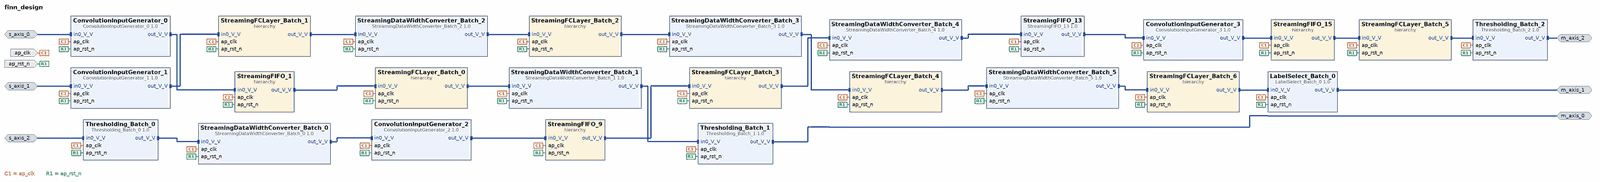
[diagram p0: block diagram of the top level, whole]
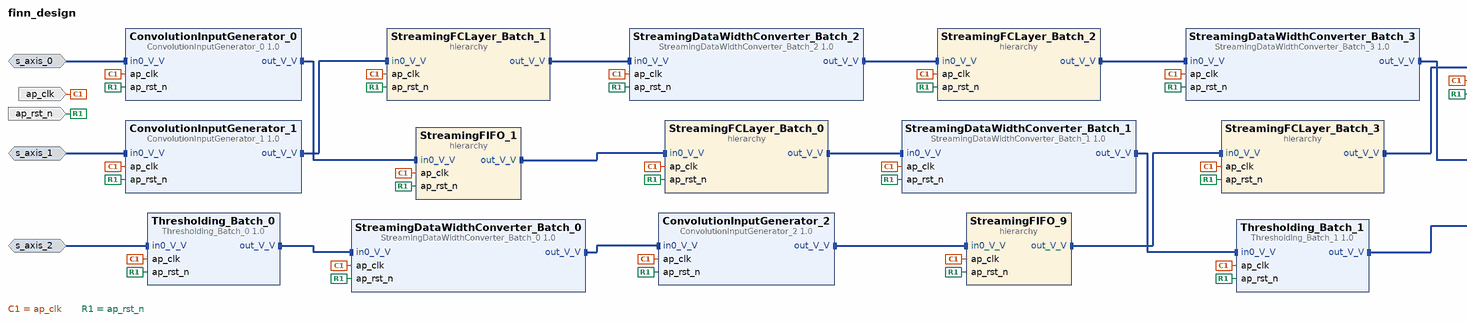
[diagram p1: block diagram of the top level, left part]
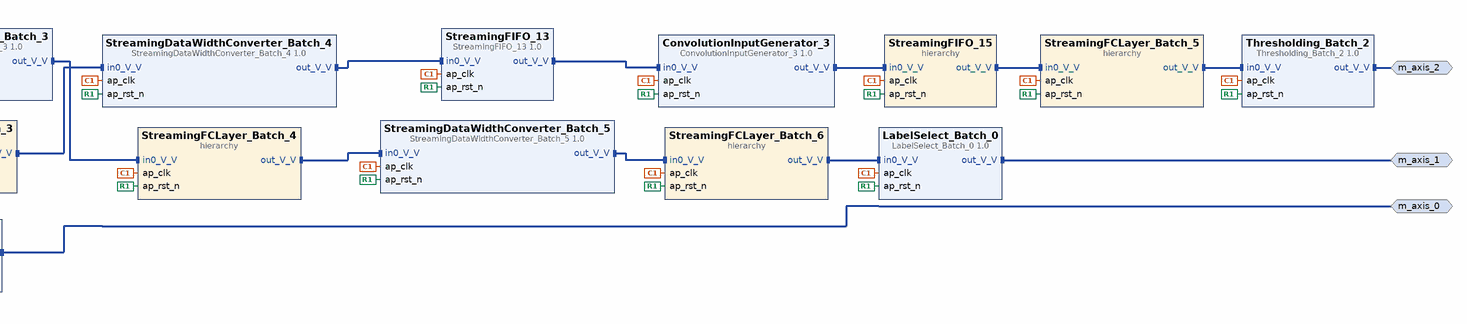
[diagram p2: block diagram of the top level, right part]
# Vivado block design finn_design, xc7z020clg400-1, Vivado 2020.1.1
create_bd_design finn_design

create_bd_intf_port -mode Slave -vlnv xilinx.com:interface:axis_rtl:1.0 s_axis_0
set_property -dict [list \
  CONFIG.TDATA_NUM_BYTES 1 \
  CONFIG.TDEST_WIDTH 0 \
  CONFIG.TID_WIDTH 0 \
  CONFIG.TUSER_WIDTH 0 \
  CONFIG.HAS_TREADY 1 \
  CONFIG.HAS_TSTRB 0 \
  CONFIG.HAS_TKEEP 0 \
  CONFIG.HAS_TLAST 0 \
  CONFIG.FREQ_HZ 100000000.000000 \
  CONFIG.LAYERED_METADATA undef \
] [get_bd_intf_ports s_axis_0]
create_bd_intf_port -mode Slave -vlnv xilinx.com:interface:axis_rtl:1.0 s_axis_1
set_property -dict [list \
  CONFIG.TDATA_NUM_BYTES 2 \
  CONFIG.TDEST_WIDTH 0 \
  CONFIG.TID_WIDTH 0 \
  CONFIG.TUSER_WIDTH 0 \
  CONFIG.HAS_TREADY 1 \
  CONFIG.HAS_TSTRB 0 \
  CONFIG.HAS_TKEEP 0 \
  CONFIG.HAS_TLAST 0 \
  CONFIG.FREQ_HZ 100000000.000000 \
  CONFIG.LAYERED_METADATA undef \
] [get_bd_intf_ports s_axis_1]
create_bd_intf_port -mode Slave -vlnv xilinx.com:interface:axis_rtl:1.0 s_axis_2
set_property -dict [list \
  CONFIG.TDATA_NUM_BYTES 1 \
  CONFIG.TDEST_WIDTH 0 \
  CONFIG.TID_WIDTH 0 \
  CONFIG.TUSER_WIDTH 0 \
  CONFIG.HAS_TREADY 1 \
  CONFIG.HAS_TSTRB 0 \
  CONFIG.HAS_TKEEP 0 \
  CONFIG.HAS_TLAST 0 \
  CONFIG.FREQ_HZ 100000000.000000 \
  CONFIG.LAYERED_METADATA undef \
] [get_bd_intf_ports s_axis_2]
create_bd_intf_port -mode Master -vlnv xilinx.com:interface:axis_rtl:1.0 m_axis_0
set_property -dict {CONFIG.FREQ_HZ 100000000.000000} [get_bd_intf_ports m_axis_0]
create_bd_intf_port -mode Master -vlnv xilinx.com:interface:axis_rtl:1.0 m_axis_1
set_property -dict {CONFIG.FREQ_HZ 100000000.000000} [get_bd_intf_ports m_axis_1]
create_bd_intf_port -mode Master -vlnv xilinx.com:interface:axis_rtl:1.0 m_axis_2
set_property -dict {CONFIG.FREQ_HZ 100000000.000000} [get_bd_intf_ports m_axis_2]
create_bd_port -dir I -type clk ap_clk
set_property -dict {CONFIG.FREQ_HZ 100000000.000000} [get_bd_ports ap_clk]
create_bd_port -dir I -type rst ap_rst_n

create_bd_cell -type ip -vlnv xilinx.com:hls:ConvolutionInputGenerator_0:1.0 ConvolutionInputGenerator_0
create_bd_cell -type ip -vlnv xilinx.com:hls:ConvolutionInputGenerator_1:1.0 ConvolutionInputGenerator_1
create_bd_cell -type ip -vlnv xilinx.com:hls:Thresholding_Batch_0:1.0 Thresholding_Batch_0
create_bd_cell -type hier StreamingFIFO_1
create_bd_cell -type hier StreamingFCLayer_Batch_1
create_bd_cell -type ip -vlnv xilinx.com:hls:StreamingDataWidthConverter_Batch_0:1.0 StreamingDataWidthConverter_Batch_0
create_bd_cell -type hier StreamingFCLayer_Batch_0
create_bd_cell -type ip -vlnv xilinx.com:hls:StreamingDataWidthConverter_Batch_2:1.0 StreamingDataWidthConverter_Batch_2
create_bd_cell -type ip -vlnv xilinx.com:hls:ConvolutionInputGenerator_2:1.0 ConvolutionInputGenerator_2
create_bd_cell -type ip -vlnv xilinx.com:hls:StreamingDataWidthConverter_Batch_1:1.0 StreamingDataWidthConverter_Batch_1
create_bd_cell -type hier StreamingFIFO_9
create_bd_cell -type hier StreamingFCLayer_Batch_2
create_bd_cell -type ip -vlnv xilinx.com:hls:Thresholding_Batch_1:1.0 Thresholding_Batch_1
create_bd_cell -type hier StreamingFCLayer_Batch_3
create_bd_cell -type ip -vlnv xilinx.com:hls:StreamingDataWidthConverter_Batch_3:1.0 StreamingDataWidthConverter_Batch_3
create_bd_cell -type ip -vlnv xilinx.com:hls:StreamingDataWidthConverter_Batch_4:1.0 StreamingDataWidthConverter_Batch_4
create_bd_cell -type hier StreamingFCLayer_Batch_4
create_bd_cell -type ip -vlnv xilinx.com:hls:StreamingFIFO_13:1.0 StreamingFIFO_13
create_bd_cell -type ip -vlnv xilinx.com:hls:StreamingDataWidthConverter_Batch_5:1.0 StreamingDataWidthConverter_Batch_5
create_bd_cell -type ip -vlnv xilinx.com:hls:ConvolutionInputGenerator_3:1.0 ConvolutionInputGenerator_3
create_bd_cell -type hier StreamingFCLayer_Batch_6
create_bd_cell -type hier StreamingFIFO_15
create_bd_cell -type ip -vlnv xilinx.com:hls:LabelSelect_Batch_0:1.0 LabelSelect_Batch_0
create_bd_cell -type hier StreamingFCLayer_Batch_5
create_bd_cell -type ip -vlnv xilinx.com:hls:Thresholding_Batch_2:1.0 Thresholding_Batch_2

# ---- hierarchy /StreamingFIFO_1 ----
current_bd_instance /StreamingFIFO_1
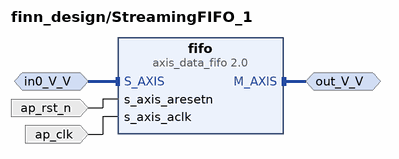
[diagram p3: block diagram inside /StreamingFIFO_1]
create_bd_intf_pin -mode Master -vlnv xilinx.com:interface:axis_rtl:1.0 out_V_V
create_bd_intf_pin -mode Slave -vlnv xilinx.com:interface:axis_rtl:1.0 in0_V_V
create_bd_pin -dir I -type clk ap_clk
create_bd_pin -dir I -type rst ap_rst_n

create_bd_cell -type ip -vlnv xilinx.com:ip:axis_data_fifo:2.0 fifo
set_property -dict {CONFIG.FIFO_DEPTH 8192 CONFIG.FIFO_MEMORY_TYPE auto CONFIG.TDATA_NUM_BYTES 1} [get_bd_cells fifo]

# ---- hierarchy /StreamingFCLayer_Batch_1 ----
current_bd_instance /StreamingFCLayer_Batch_1
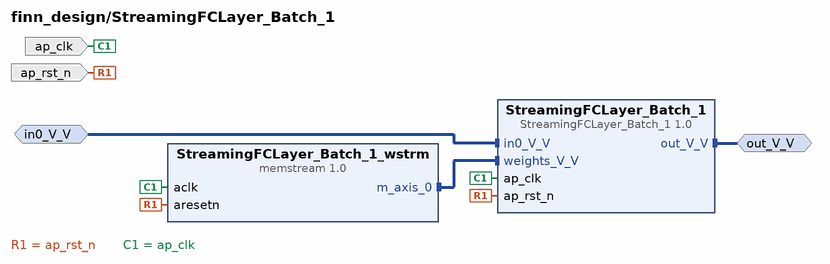
[diagram p4: block diagram inside /StreamingFCLayer_Batch_1]
create_bd_intf_pin -mode Master -vlnv xilinx.com:interface:axis_rtl:1.0 out_V_V
create_bd_intf_pin -mode Slave -vlnv xilinx.com:interface:axis_rtl:1.0 in0_V_V
create_bd_pin -dir I -type clk ap_clk
create_bd_pin -dir I -type rst ap_rst_n

create_bd_cell -type ip -vlnv xilinx.com:hls:StreamingFCLayer_Batch_1:1.0 StreamingFCLayer_Batch_1
create_bd_cell -type ip -vlnv xilinx.com:user:memstream:1.0 StreamingFCLayer_Batch_1_wstrm
set_property -dict [list \
  CONFIG.MEM_DEPTH 36864 \
  CONFIG.MEM_INIT /home/grgov/Diplomski_rad/finn_modified_docker_output_dir/code_gen_ipgen_StreamingFCLayer_Batch_1_gj26dggu/ \
  CONFIG.MEM_WIDTH 64 \
  CONFIG.NSTREAMS 1 \
  CONFIG.RAM_STYLE auto \
  CONFIG.STRM0_DEPTH 36864 \
  CONFIG.STRM0_OFFSET 0 \
  CONFIG.STRM0_WIDTH 64 \
] [get_bd_cells StreamingFCLayer_Batch_1_wstrm]

# ---- hierarchy /StreamingFCLayer_Batch_0 ----
current_bd_instance /StreamingFCLayer_Batch_0
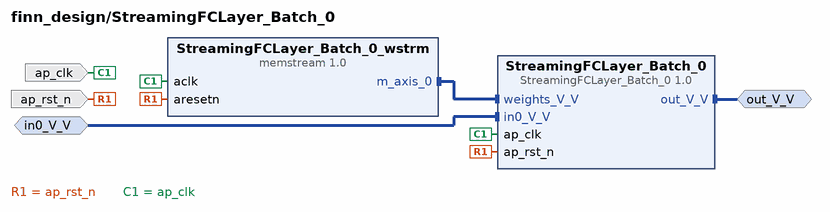
[diagram p5: block diagram inside /StreamingFCLayer_Batch_0]
create_bd_intf_pin -mode Master -vlnv xilinx.com:interface:axis_rtl:1.0 out_V_V
create_bd_intf_pin -mode Slave -vlnv xilinx.com:interface:axis_rtl:1.0 in0_V_V
create_bd_pin -dir I -type clk ap_clk
create_bd_pin -dir I -type rst ap_rst_n

create_bd_cell -type ip -vlnv xilinx.com:hls:StreamingFCLayer_Batch_0:1.0 StreamingFCLayer_Batch_0
create_bd_cell -type ip -vlnv xilinx.com:user:memstream:1.0 StreamingFCLayer_Batch_0_wstrm
set_property -dict [list \
  CONFIG.MEM_DEPTH 18432 \
  CONFIG.MEM_INIT /home/grgov/Diplomski_rad/finn_modified_docker_output_dir/code_gen_ipgen_StreamingFCLayer_Batch_0_a2ilano3/ \
  CONFIG.MEM_WIDTH 32 \
  CONFIG.NSTREAMS 1 \
  CONFIG.RAM_STYLE auto \
  CONFIG.STRM0_DEPTH 18432 \
  CONFIG.STRM0_OFFSET 0 \
  CONFIG.STRM0_WIDTH 32 \
] [get_bd_cells StreamingFCLayer_Batch_0_wstrm]

# ---- hierarchy /StreamingFIFO_9 ----
current_bd_instance /StreamingFIFO_9
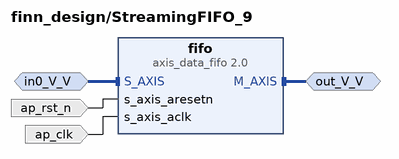
[diagram p6: block diagram inside /StreamingFIFO_9]
create_bd_intf_pin -mode Master -vlnv xilinx.com:interface:axis_rtl:1.0 out_V_V
create_bd_intf_pin -mode Slave -vlnv xilinx.com:interface:axis_rtl:1.0 in0_V_V
create_bd_pin -dir I -type clk ap_clk
create_bd_pin -dir I -type rst ap_rst_n

create_bd_cell -type ip -vlnv xilinx.com:ip:axis_data_fifo:2.0 fifo
set_property -dict {CONFIG.FIFO_DEPTH 512 CONFIG.FIFO_MEMORY_TYPE auto CONFIG.TDATA_NUM_BYTES 3} [get_bd_cells fifo]

# ---- hierarchy /StreamingFCLayer_Batch_2 ----
current_bd_instance /StreamingFCLayer_Batch_2
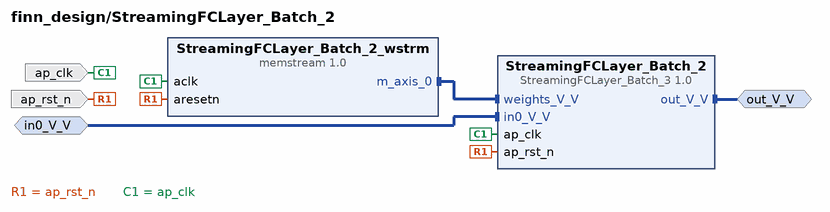
[diagram p7: block diagram inside /StreamingFCLayer_Batch_2]
create_bd_intf_pin -mode Master -vlnv xilinx.com:interface:axis_rtl:1.0 out_V_V
create_bd_intf_pin -mode Slave -vlnv xilinx.com:interface:axis_rtl:1.0 in0_V_V
create_bd_pin -dir I -type clk ap_clk
create_bd_pin -dir I -type rst ap_rst_n

create_bd_cell -type ip -vlnv xilinx.com:hls:StreamingFCLayer_Batch_3:1.0 StreamingFCLayer_Batch_2
create_bd_cell -type ip -vlnv xilinx.com:user:memstream:1.0 StreamingFCLayer_Batch_2_wstrm
set_property -dict [list \
  CONFIG.MEM_DEPTH 4096 \
  CONFIG.MEM_INIT /home/grgov/Diplomski_rad/finn_modified_docker_output_dir/code_gen_ipgen_StreamingFCLayer_Batch_3_u6fssgdv/ \
  CONFIG.MEM_WIDTH 128 \
  CONFIG.NSTREAMS 1 \
  CONFIG.RAM_STYLE block \
  CONFIG.STRM0_DEPTH 4096 \
  CONFIG.STRM0_OFFSET 0 \
  CONFIG.STRM0_WIDTH 128 \
] [get_bd_cells StreamingFCLayer_Batch_2_wstrm]

# ---- hierarchy /StreamingFCLayer_Batch_3 ----
current_bd_instance /StreamingFCLayer_Batch_3
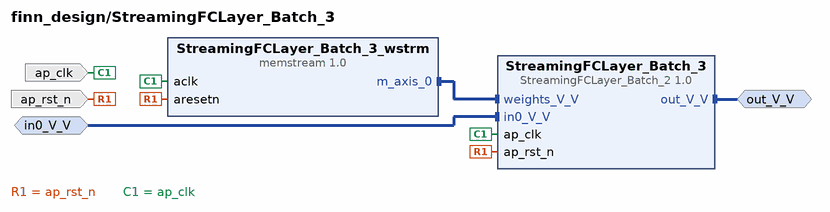
[diagram p8: block diagram inside /StreamingFCLayer_Batch_3]
create_bd_intf_pin -mode Master -vlnv xilinx.com:interface:axis_rtl:1.0 out_V_V
create_bd_intf_pin -mode Slave -vlnv xilinx.com:interface:axis_rtl:1.0 in0_V_V
create_bd_pin -dir I -type clk ap_clk
create_bd_pin -dir I -type rst ap_rst_n

create_bd_cell -type ip -vlnv xilinx.com:hls:StreamingFCLayer_Batch_2:1.0 StreamingFCLayer_Batch_3
create_bd_cell -type ip -vlnv xilinx.com:user:memstream:1.0 StreamingFCLayer_Batch_3_wstrm
set_property -dict [list \
  CONFIG.MEM_DEPTH 144 \
  CONFIG.MEM_INIT /home/grgov/Diplomski_rad/finn_modified_docker_output_dir/code_gen_ipgen_StreamingFCLayer_Batch_2_4yckv8t4/ \
  CONFIG.MEM_WIDTH 48 \
  CONFIG.NSTREAMS 1 \
  CONFIG.RAM_STYLE auto \
  CONFIG.STRM0_DEPTH 144 \
  CONFIG.STRM0_OFFSET 0 \
  CONFIG.STRM0_WIDTH 48 \
] [get_bd_cells StreamingFCLayer_Batch_3_wstrm]

# ---- hierarchy /StreamingFCLayer_Batch_4 ----
current_bd_instance /StreamingFCLayer_Batch_4
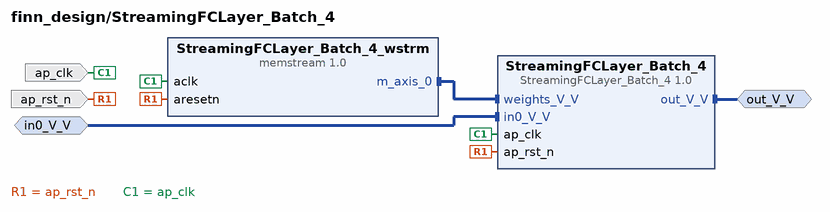
[diagram p9: block diagram inside /StreamingFCLayer_Batch_4]
create_bd_intf_pin -mode Master -vlnv xilinx.com:interface:axis_rtl:1.0 out_V_V
create_bd_intf_pin -mode Slave -vlnv xilinx.com:interface:axis_rtl:1.0 in0_V_V
create_bd_pin -dir I -type clk ap_clk
create_bd_pin -dir I -type rst ap_rst_n

create_bd_cell -type ip -vlnv xilinx.com:hls:StreamingFCLayer_Batch_4:1.0 StreamingFCLayer_Batch_4
create_bd_cell -type ip -vlnv xilinx.com:user:memstream:1.0 StreamingFCLayer_Batch_4_wstrm
set_property -dict [list \
  CONFIG.MEM_DEPTH 8192 \
  CONFIG.MEM_INIT /home/grgov/Diplomski_rad/finn_modified_docker_output_dir/code_gen_ipgen_StreamingFCLayer_Batch_4_2kaxius9/ \
  CONFIG.MEM_WIDTH 128 \
  CONFIG.NSTREAMS 1 \
  CONFIG.RAM_STYLE auto \
  CONFIG.STRM0_DEPTH 8192 \
  CONFIG.STRM0_OFFSET 0 \
  CONFIG.STRM0_WIDTH 128 \
] [get_bd_cells StreamingFCLayer_Batch_4_wstrm]

# ---- hierarchy /StreamingFCLayer_Batch_6 ----
current_bd_instance /StreamingFCLayer_Batch_6
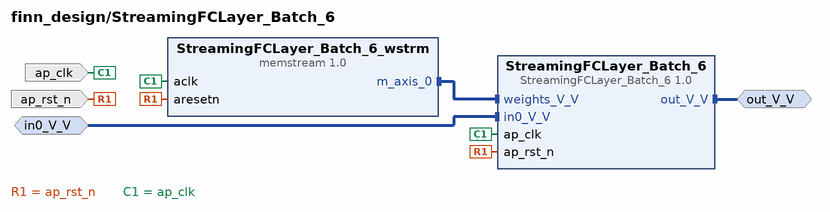
[diagram p10: block diagram inside /StreamingFCLayer_Batch_6]
create_bd_intf_pin -mode Master -vlnv xilinx.com:interface:axis_rtl:1.0 out_V_V
create_bd_intf_pin -mode Slave -vlnv xilinx.com:interface:axis_rtl:1.0 in0_V_V
create_bd_pin -dir I -type clk ap_clk
create_bd_pin -dir I -type rst ap_rst_n

create_bd_cell -type ip -vlnv xilinx.com:hls:StreamingFCLayer_Batch_6:1.0 StreamingFCLayer_Batch_6
create_bd_cell -type ip -vlnv xilinx.com:user:memstream:1.0 StreamingFCLayer_Batch_6_wstrm
set_property -dict [list \
  CONFIG.MEM_DEPTH 1792 \
  CONFIG.MEM_INIT /home/grgov/Diplomski_rad/finn_modified_docker_output_dir/code_gen_ipgen_StreamingFCLayer_Batch_6_e2ail04f/ \
  CONFIG.MEM_WIDTH 8 \
  CONFIG.NSTREAMS 1 \
  CONFIG.RAM_STYLE distributed \
  CONFIG.STRM0_DEPTH 1792 \
  CONFIG.STRM0_OFFSET 0 \
  CONFIG.STRM0_WIDTH 8 \
] [get_bd_cells StreamingFCLayer_Batch_6_wstrm]

# ---- hierarchy /StreamingFIFO_15 ----
current_bd_instance /StreamingFIFO_15
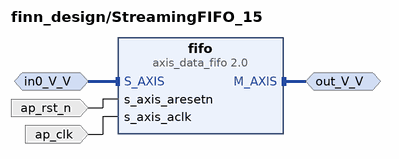
[diagram p11: block diagram inside /StreamingFIFO_15]
create_bd_intf_pin -mode Master -vlnv xilinx.com:interface:axis_rtl:1.0 out_V_V
create_bd_intf_pin -mode Slave -vlnv xilinx.com:interface:axis_rtl:1.0 in0_V_V
create_bd_pin -dir I -type clk ap_clk
create_bd_pin -dir I -type rst ap_rst_n

create_bd_cell -type ip -vlnv xilinx.com:ip:axis_data_fifo:2.0 fifo
set_property -dict {CONFIG.FIFO_DEPTH 2048 CONFIG.FIFO_MEMORY_TYPE auto CONFIG.TDATA_NUM_BYTES 4} [get_bd_cells fifo]

# ---- hierarchy /StreamingFCLayer_Batch_5 ----
current_bd_instance /StreamingFCLayer_Batch_5
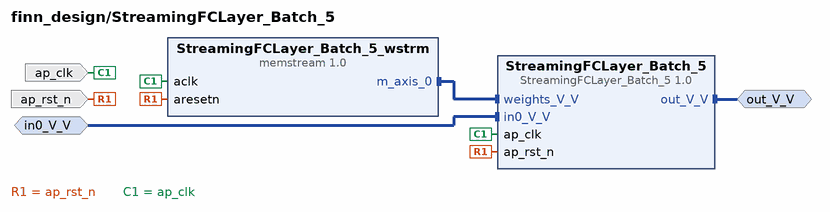
[diagram p12: block diagram inside /StreamingFCLayer_Batch_5]
create_bd_intf_pin -mode Master -vlnv xilinx.com:interface:axis_rtl:1.0 out_V_V
create_bd_intf_pin -mode Slave -vlnv xilinx.com:interface:axis_rtl:1.0 in0_V_V
create_bd_pin -dir I -type clk ap_clk
create_bd_pin -dir I -type rst ap_rst_n

create_bd_cell -type ip -vlnv xilinx.com:hls:StreamingFCLayer_Batch_5:1.0 StreamingFCLayer_Batch_5
create_bd_cell -type ip -vlnv xilinx.com:user:memstream:1.0 StreamingFCLayer_Batch_5_wstrm
set_property -dict [list \
  CONFIG.MEM_DEPTH 4608 \
  CONFIG.MEM_INIT /home/grgov/Diplomski_rad/finn_modified_docker_output_dir/code_gen_ipgen_StreamingFCLayer_Batch_5_g5ap2jtp/ \
  CONFIG.MEM_WIDTH 32 \
  CONFIG.NSTREAMS 1 \
  CONFIG.RAM_STYLE auto \
  CONFIG.STRM0_DEPTH 4608 \
  CONFIG.STRM0_OFFSET 0 \
  CONFIG.STRM0_WIDTH 32 \
] [get_bd_cells StreamingFCLayer_Batch_5_wstrm]

# ---- connections ----

current_bd_instance /StreamingFIFO_1
connect_bd_intf_net [get_bd_intf_pins out_V_V] [get_bd_intf_pins fifo/M_AXIS]
connect_bd_intf_net [get_bd_intf_pins in0_V_V] [get_bd_intf_pins fifo/S_AXIS]
connect_bd_net [get_bd_pins ap_rst_n] [get_bd_pins fifo/s_axis_aresetn]
connect_bd_net [get_bd_pins ap_clk] [get_bd_pins fifo/s_axis_aclk]

current_bd_instance /StreamingFCLayer_Batch_1
connect_bd_intf_net [get_bd_intf_pins out_V_V] [get_bd_intf_pins StreamingFCLayer_Batch_1/out_V_V]
connect_bd_intf_net [get_bd_intf_pins in0_V_V] [get_bd_intf_pins StreamingFCLayer_Batch_1/in0_V_V]
connect_bd_intf_net [get_bd_intf_pins StreamingFCLayer_Batch_1_wstrm/m_axis_0] [get_bd_intf_pins StreamingFCLayer_Batch_1/weights_V_V]
connect_bd_net [get_bd_pins ap_rst_n] [get_bd_pins StreamingFCLayer_Batch_1_wstrm/aresetn] [get_bd_pins StreamingFCLayer_Batch_1/ap_rst_n]
connect_bd_net [get_bd_pins ap_clk] [get_bd_pins StreamingFCLayer_Batch_1_wstrm/aclk] [get_bd_pins StreamingFCLayer_Batch_1/ap_clk]

current_bd_instance /StreamingFCLayer_Batch_0
connect_bd_intf_net [get_bd_intf_pins StreamingFCLayer_Batch_0_wstrm/m_axis_0] [get_bd_intf_pins StreamingFCLayer_Batch_0/weights_V_V]
connect_bd_intf_net [get_bd_intf_pins in0_V_V] [get_bd_intf_pins StreamingFCLayer_Batch_0/in0_V_V]
connect_bd_intf_net [get_bd_intf_pins out_V_V] [get_bd_intf_pins StreamingFCLayer_Batch_0/out_V_V]
connect_bd_net [get_bd_pins ap_rst_n] [get_bd_pins StreamingFCLayer_Batch_0_wstrm/aresetn] [get_bd_pins StreamingFCLayer_Batch_0/ap_rst_n]
connect_bd_net [get_bd_pins ap_clk] [get_bd_pins StreamingFCLayer_Batch_0_wstrm/aclk] [get_bd_pins StreamingFCLayer_Batch_0/ap_clk]

current_bd_instance /StreamingFIFO_9
connect_bd_intf_net [get_bd_intf_pins out_V_V] [get_bd_intf_pins fifo/M_AXIS]
connect_bd_intf_net [get_bd_intf_pins in0_V_V] [get_bd_intf_pins fifo/S_AXIS]
connect_bd_net [get_bd_pins ap_rst_n] [get_bd_pins fifo/s_axis_aresetn]
connect_bd_net [get_bd_pins ap_clk] [get_bd_pins fifo/s_axis_aclk]

current_bd_instance /StreamingFCLayer_Batch_2
connect_bd_intf_net [get_bd_intf_pins StreamingFCLayer_Batch_2_wstrm/m_axis_0] [get_bd_intf_pins StreamingFCLayer_Batch_2/weights_V_V]
connect_bd_intf_net [get_bd_intf_pins in0_V_V] [get_bd_intf_pins StreamingFCLayer_Batch_2/in0_V_V]
connect_bd_intf_net [get_bd_intf_pins out_V_V] [get_bd_intf_pins StreamingFCLayer_Batch_2/out_V_V]
connect_bd_net [get_bd_pins ap_rst_n] [get_bd_pins StreamingFCLayer_Batch_2_wstrm/aresetn] [get_bd_pins StreamingFCLayer_Batch_2/ap_rst_n]
connect_bd_net [get_bd_pins ap_clk] [get_bd_pins StreamingFCLayer_Batch_2_wstrm/aclk] [get_bd_pins StreamingFCLayer_Batch_2/ap_clk]

current_bd_instance /StreamingFCLayer_Batch_3
connect_bd_intf_net [get_bd_intf_pins StreamingFCLayer_Batch_3_wstrm/m_axis_0] [get_bd_intf_pins StreamingFCLayer_Batch_3/weights_V_V]
connect_bd_intf_net [get_bd_intf_pins in0_V_V] [get_bd_intf_pins StreamingFCLayer_Batch_3/in0_V_V]
connect_bd_intf_net [get_bd_intf_pins out_V_V] [get_bd_intf_pins StreamingFCLayer_Batch_3/out_V_V]
connect_bd_net [get_bd_pins ap_rst_n] [get_bd_pins StreamingFCLayer_Batch_3_wstrm/aresetn] [get_bd_pins StreamingFCLayer_Batch_3/ap_rst_n]
connect_bd_net [get_bd_pins ap_clk] [get_bd_pins StreamingFCLayer_Batch_3_wstrm/aclk] [get_bd_pins StreamingFCLayer_Batch_3/ap_clk]

current_bd_instance /StreamingFCLayer_Batch_4
connect_bd_intf_net [get_bd_intf_pins StreamingFCLayer_Batch_4_wstrm/m_axis_0] [get_bd_intf_pins StreamingFCLayer_Batch_4/weights_V_V]
connect_bd_intf_net [get_bd_intf_pins in0_V_V] [get_bd_intf_pins StreamingFCLayer_Batch_4/in0_V_V]
connect_bd_intf_net [get_bd_intf_pins out_V_V] [get_bd_intf_pins StreamingFCLayer_Batch_4/out_V_V]
connect_bd_net [get_bd_pins ap_rst_n] [get_bd_pins StreamingFCLayer_Batch_4_wstrm/aresetn] [get_bd_pins StreamingFCLayer_Batch_4/ap_rst_n]
connect_bd_net [get_bd_pins ap_clk] [get_bd_pins StreamingFCLayer_Batch_4_wstrm/aclk] [get_bd_pins StreamingFCLayer_Batch_4/ap_clk]

current_bd_instance /StreamingFCLayer_Batch_6
connect_bd_intf_net [get_bd_intf_pins StreamingFCLayer_Batch_6_wstrm/m_axis_0] [get_bd_intf_pins StreamingFCLayer_Batch_6/weights_V_V]
connect_bd_intf_net [get_bd_intf_pins in0_V_V] [get_bd_intf_pins StreamingFCLayer_Batch_6/in0_V_V]
connect_bd_intf_net [get_bd_intf_pins out_V_V] [get_bd_intf_pins StreamingFCLayer_Batch_6/out_V_V]
connect_bd_net [get_bd_pins ap_rst_n] [get_bd_pins StreamingFCLayer_Batch_6_wstrm/aresetn] [get_bd_pins StreamingFCLayer_Batch_6/ap_rst_n]
connect_bd_net [get_bd_pins ap_clk] [get_bd_pins StreamingFCLayer_Batch_6_wstrm/aclk] [get_bd_pins StreamingFCLayer_Batch_6/ap_clk]

current_bd_instance /StreamingFIFO_15
connect_bd_intf_net [get_bd_intf_pins out_V_V] [get_bd_intf_pins fifo/M_AXIS]
connect_bd_intf_net [get_bd_intf_pins in0_V_V] [get_bd_intf_pins fifo/S_AXIS]
connect_bd_net [get_bd_pins ap_rst_n] [get_bd_pins fifo/s_axis_aresetn]
connect_bd_net [get_bd_pins ap_clk] [get_bd_pins fifo/s_axis_aclk]

current_bd_instance /StreamingFCLayer_Batch_5
connect_bd_intf_net [get_bd_intf_pins StreamingFCLayer_Batch_5_wstrm/m_axis_0] [get_bd_intf_pins StreamingFCLayer_Batch_5/weights_V_V]
connect_bd_intf_net [get_bd_intf_pins in0_V_V] [get_bd_intf_pins StreamingFCLayer_Batch_5/in0_V_V]
connect_bd_intf_net [get_bd_intf_pins out_V_V] [get_bd_intf_pins StreamingFCLayer_Batch_5/out_V_V]
connect_bd_net [get_bd_pins ap_rst_n] [get_bd_pins StreamingFCLayer_Batch_5_wstrm/aresetn] [get_bd_pins StreamingFCLayer_Batch_5/ap_rst_n]
connect_bd_net [get_bd_pins ap_clk] [get_bd_pins StreamingFCLayer_Batch_5_wstrm/aclk] [get_bd_pins StreamingFCLayer_Batch_5/ap_clk]

current_bd_instance /
connect_bd_intf_net [get_bd_intf_pins StreamingDataWidthConverter_Batch_1/out_V_V] [get_bd_intf_pins Thresholding_Batch_1/in0_V_V]
connect_bd_intf_net [get_bd_intf_ports m_axis_0] [get_bd_intf_pins Thresholding_Batch_1/out_V_V]
connect_bd_intf_net [get_bd_intf_pins StreamingFIFO_9/out_V_V] [get_bd_intf_pins StreamingFCLayer_Batch_3/in0_V_V]
connect_bd_intf_net [get_bd_intf_pins StreamingFCLayer_Batch_2/out_V_V] [get_bd_intf_pins StreamingDataWidthConverter_Batch_3/in0_V_V]
connect_bd_intf_net [get_bd_intf_pins StreamingFCLayer_Batch_3/out_V_V] [get_bd_intf_pins StreamingDataWidthConverter_Batch_4/in0_V_V]
connect_bd_intf_net [get_bd_intf_pins StreamingDataWidthConverter_Batch_3/out_V_V] [get_bd_intf_pins StreamingFCLayer_Batch_4/in0_V_V]
connect_bd_intf_net [get_bd_intf_pins StreamingFCLayer_Batch_4/out_V_V] [get_bd_intf_pins StreamingDataWidthConverter_Batch_5/in0_V_V]
connect_bd_intf_net [get_bd_intf_pins StreamingFIFO_13/out_V_V] [get_bd_intf_pins ConvolutionInputGenerator_3/in0_V_V]
connect_bd_intf_net [get_bd_intf_pins StreamingDataWidthConverter_Batch_5/out_V_V] [get_bd_intf_pins StreamingFCLayer_Batch_6/in0_V_V]
connect_bd_intf_net [get_bd_intf_pins ConvolutionInputGenerator_3/out_V_V] [get_bd_intf_pins StreamingFIFO_15/in0_V_V]
connect_bd_intf_net [get_bd_intf_pins StreamingFCLayer_Batch_6/out_V_V] [get_bd_intf_pins LabelSelect_Batch_0/in0_V_V]
connect_bd_intf_net [get_bd_intf_ports m_axis_1] [get_bd_intf_pins LabelSelect_Batch_0/out_V_V]
connect_bd_intf_net [get_bd_intf_pins StreamingFIFO_15/out_V_V] [get_bd_intf_pins StreamingFCLayer_Batch_5/in0_V_V]
connect_bd_intf_net [get_bd_intf_pins StreamingFCLayer_Batch_5/out_V_V] [get_bd_intf_pins Thresholding_Batch_2/in0_V_V]
connect_bd_intf_net [get_bd_intf_ports m_axis_2] [get_bd_intf_pins Thresholding_Batch_2/out_V_V]
connect_bd_intf_net [get_bd_intf_pins StreamingDataWidthConverter_Batch_4/out_V_V] [get_bd_intf_pins StreamingFIFO_13/in0_V_V]
connect_bd_intf_net -intf_net in0_V_V_0_1 [get_bd_intf_ports s_axis_0] [get_bd_intf_pins ConvolutionInputGenerator_0/in0_V_V]
connect_bd_intf_net -intf_net in0_V_V_0_2 [get_bd_intf_ports s_axis_1] [get_bd_intf_pins ConvolutionInputGenerator_1/in0_V_V]
connect_bd_intf_net [get_bd_intf_pins StreamingDataWidthConverter_Batch_2/out_V_V] [get_bd_intf_pins StreamingFCLayer_Batch_2/in0_V_V]
connect_bd_intf_net [get_bd_intf_pins ConvolutionInputGenerator_2/out_V_V] [get_bd_intf_pins StreamingFIFO_9/in0_V_V]
connect_bd_intf_net [get_bd_intf_pins StreamingFCLayer_Batch_0/out_V_V] [get_bd_intf_pins StreamingDataWidthConverter_Batch_1/in0_V_V]
connect_bd_intf_net [get_bd_intf_pins StreamingDataWidthConverter_Batch_0/out_V_V] [get_bd_intf_pins ConvolutionInputGenerator_2/in0_V_V]
connect_bd_intf_net [get_bd_intf_pins StreamingFCLayer_Batch_1/out_V_V] [get_bd_intf_pins StreamingDataWidthConverter_Batch_2/in0_V_V]
connect_bd_intf_net [get_bd_intf_pins StreamingFIFO_1/out_V_V] [get_bd_intf_pins StreamingFCLayer_Batch_0/in0_V_V]
connect_bd_intf_net -intf_net in0_V_V_0_3 [get_bd_intf_ports s_axis_2] [get_bd_intf_pins Thresholding_Batch_0/in0_V_V]
connect_bd_intf_net [get_bd_intf_pins ConvolutionInputGenerator_0/out_V_V] [get_bd_intf_pins StreamingFIFO_1/in0_V_V]
connect_bd_intf_net [get_bd_intf_pins ConvolutionInputGenerator_1/out_V_V] [get_bd_intf_pins StreamingFCLayer_Batch_1/in0_V_V]
connect_bd_intf_net [get_bd_intf_pins Thresholding_Batch_0/out_V_V] [get_bd_intf_pins StreamingDataWidthConverter_Batch_0/in0_V_V]
connect_bd_net -net ap_clk_0_1 [get_bd_ports ap_clk] \
  [get_bd_pins ConvolutionInputGenerator_0/ap_clk] [get_bd_pins ConvolutionInputGenerator_1/ap_clk] \
  [get_bd_pins Thresholding_Batch_0/ap_clk] [get_bd_pins StreamingFIFO_1/ap_clk] \
  [get_bd_pins StreamingFCLayer_Batch_1/ap_clk] [get_bd_pins StreamingDataWidthConverter_Batch_0/ap_clk] \
  [get_bd_pins StreamingFCLayer_Batch_0/ap_clk] [get_bd_pins StreamingDataWidthConverter_Batch_2/ap_clk] \
  [get_bd_pins ConvolutionInputGenerator_2/ap_clk] [get_bd_pins StreamingDataWidthConverter_Batch_1/ap_clk] \
  [get_bd_pins StreamingFIFO_9/ap_clk] [get_bd_pins StreamingFCLayer_Batch_2/ap_clk] \
  [get_bd_pins Thresholding_Batch_1/ap_clk] [get_bd_pins StreamingFCLayer_Batch_3/ap_clk] \
  [get_bd_pins StreamingDataWidthConverter_Batch_3/ap_clk] [get_bd_pins StreamingDataWidthConverter_Batch_4/ap_clk] \
  [get_bd_pins StreamingFCLayer_Batch_4/ap_clk] [get_bd_pins StreamingFIFO_13/ap_clk] \
  [get_bd_pins StreamingDataWidthConverter_Batch_5/ap_clk] [get_bd_pins ConvolutionInputGenerator_3/ap_clk] \
  [get_bd_pins StreamingFCLayer_Batch_6/ap_clk] [get_bd_pins StreamingFIFO_15/ap_clk] \
  [get_bd_pins LabelSelect_Batch_0/ap_clk] [get_bd_pins StreamingFCLayer_Batch_5/ap_clk] \
  [get_bd_pins Thresholding_Batch_2/ap_clk]
connect_bd_net -net ap_rst_n_0_1 [get_bd_ports ap_rst_n] \
  [get_bd_pins ConvolutionInputGenerator_0/ap_rst_n] [get_bd_pins ConvolutionInputGenerator_1/ap_rst_n] \
  [get_bd_pins Thresholding_Batch_0/ap_rst_n] [get_bd_pins StreamingFIFO_1/ap_rst_n] \
  [get_bd_pins StreamingFCLayer_Batch_1/ap_rst_n] [get_bd_pins StreamingDataWidthConverter_Batch_0/ap_rst_n] \
  [get_bd_pins StreamingFCLayer_Batch_0/ap_rst_n] [get_bd_pins StreamingDataWidthConverter_Batch_2/ap_rst_n] \
  [get_bd_pins ConvolutionInputGenerator_2/ap_rst_n] [get_bd_pins StreamingDataWidthConverter_Batch_1/ap_rst_n] \
  [get_bd_pins StreamingFIFO_9/ap_rst_n] [get_bd_pins StreamingFCLayer_Batch_2/ap_rst_n] \
  [get_bd_pins Thresholding_Batch_1/ap_rst_n] [get_bd_pins StreamingFCLayer_Batch_3/ap_rst_n] \
  [get_bd_pins StreamingDataWidthConverter_Batch_3/ap_rst_n] [get_bd_pins StreamingDataWidthConverter_Batch_4/ap_rst_n] \
  [get_bd_pins StreamingFCLayer_Batch_4/ap_rst_n] [get_bd_pins StreamingFIFO_13/ap_rst_n] \
  [get_bd_pins StreamingDataWidthConverter_Batch_5/ap_rst_n] [get_bd_pins ConvolutionInputGenerator_3/ap_rst_n] \
  [get_bd_pins StreamingFCLayer_Batch_6/ap_rst_n] [get_bd_pins StreamingFIFO_15/ap_rst_n] \
  [get_bd_pins LabelSelect_Batch_0/ap_rst_n] [get_bd_pins StreamingFCLayer_Batch_5/ap_rst_n] \
  [get_bd_pins Thresholding_Batch_2/ap_rst_n]

validate_bd_design
save_bd_design
